# Altium schematic sheet programming.SchDoc
size A4
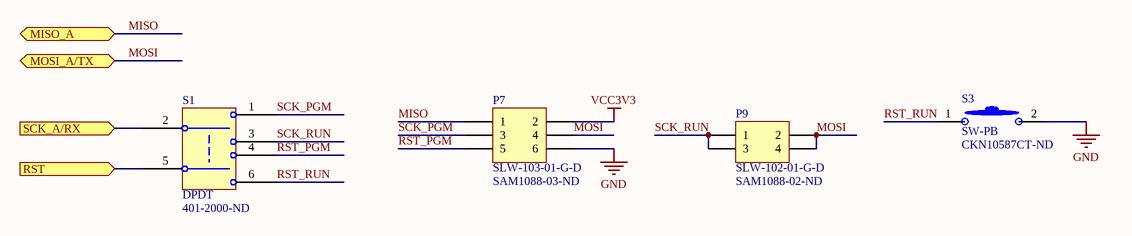
[diagram p0: programming.SchDoc]

## Parts
P7  SLW-103-01-G-D  Supplier Part Number 1: SAM1088-03-ND  [SLW-103-01-X-D]
P9  SLW-102-01-G-D  Supplier Part Number 1: SAM1088-02-ND  [SLW-102-01-X-D]
S1  DPDT  Supplier Part Number 1: 401-2000-ND  [JS202011AQN - Slide Switch]
S3  SW-PB  Supplier Part Number 1: CKN10587CT-ND  [PTS830GM140 SMTR LFS - Pushbutton]

## Ports
MISO_A (bidir), MOSI_A/TX (bidir), RST (in), SCK_A/RX (in)

## Nets
GND: P7.6 S3.2
VCC3V3: P7.2
MISO: P7.1 ; port MISO_A
MOSI: P7.4 P9.2 P9.4 ; port MOSI_A/TX
RST: S1.5(POLE2) ; port RST
RST_PGM: P7.5 S1.4(POLE2A)
RST_RUN: S1.6(POLE2B) S3.1
SCK_A/RX: S1.2(POLE1) ; port SCK_A/RX
SCK_PGM: P7.3 S1.1(POLE1A)
SCK_RUN: P9.1 P9.3 S1.3(POLE1B)

## Library data of the parts
P7 = SLW-103-01-G-D: 6 pos 100mil pitch low profile header; Supplier 1: Digi-Key
P9 = SLW-102-01-G-D: 4 pos 100mil pitch low profile header; Supplier 1: Digi-Key
S1 = DPDT Switch: DPDT Switch, customized for the pinout of the JS202011AQN switch.; Supplier 1: Digi-Key
S3 = Pushbutton - Low Profile: Schematic symbol for a generic 2-pin pushbutton, OFF-mom.; Supplier 1: Digi-Key